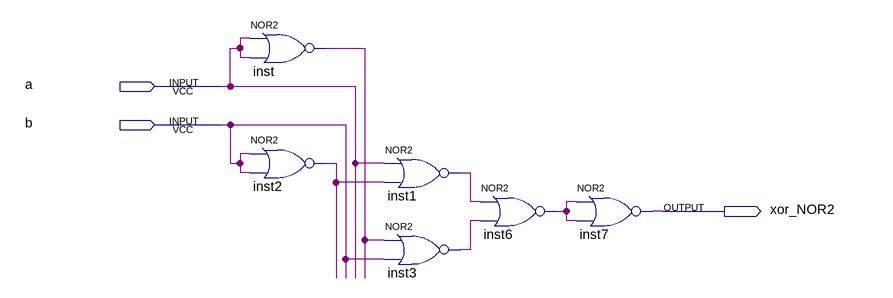
[diagram p0: schematic sheet]
// Quartus schematic xor_NOR2.bdf as structural Verilog: 6 symbols, 3 pins
module xor_NOR2 (
  input  a,
  input  b,
  output xor_NOR2
);

  wire inst1_out, inst2_out, inst3_out, inst6_out, inst_out;

  nor inst (inst_out, a, a);
  nor inst2 (inst2_out, b, b);
  nor inst1 (inst1_out, a, inst2_out);
  nor inst3 (inst3_out, inst_out, b);
  nor inst6 (inst6_out, inst1_out, inst3_out);
  nor inst7 (xor_NOR2, inst6_out, inst6_out);
endmodule
